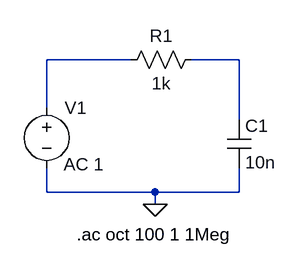
[diagram p0: schematic RC_filter.asc]
RC_filter.asc, the LTspice schematic file:
Version 4
SHEET 1 880 680
WIRE 96 32 -16 32
WIRE 240 32 176 32
WIRE -16 96 -16 32
WIRE 240 112 240 32
WIRE -16 208 -16 176
WIRE 128 208 -16 208
WIRE 240 208 240 176
WIRE 240 208 128 208
WIRE 128 224 128 208
FLAG 128 224 0
SYMBOL cap 224 112 R0
SYMATTR InstName C1
SYMATTR Value 10n
SYMBOL res 192 16 R90
WINDOW 0 0 56 VBottom 2
WINDOW 3 32 56 VTop 2
SYMATTR InstName R1
SYMATTR Value 1k
SYMBOL voltage -16 80 R0
WINDOW 123 23 91 Left 2
WINDOW 39 0 0 Left 2
SYMATTR InstName V1
SYMATTR Value ""
SYMATTR Value2 AC 1
TEXT 24 264 Left 2 !.ac oct 100 1 1Meg

The netlist it stands for:
* RC_filter.asc
C1 N002 0 10n
R1 N002 N001 1k
V1 N001 0 AC 1
.ac oct 100 1 1Meg
.backanno
.end